# Altium schematic sheet Regulators.SchDoc
size A; SheetNumber: 5; SheetTotal: 6
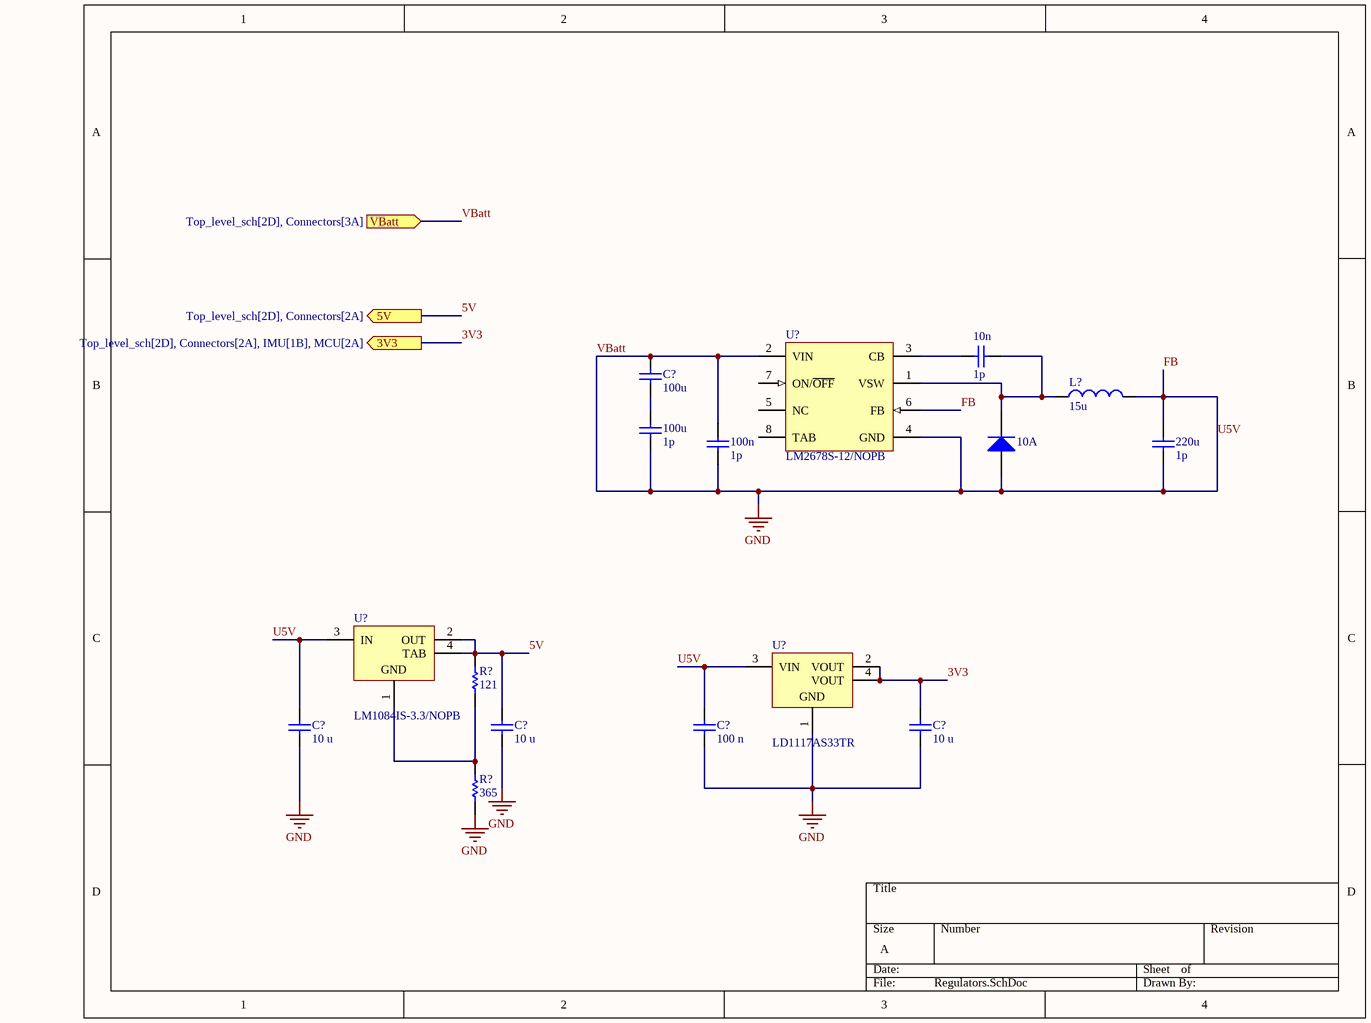
[diagram p0: Regulators.SchDoc]

## Parts
(Parts that share a designator on the sheet are numbered #1, #2 ... from top to bottom, then left to right.)
10A  Diode  (value not drawn)
10n  value 1p  (hidden comment: Capacitor)
100n  value 1p  (hidden comment: Capacitor)
100u  value 1p  (hidden comment: Capacitor)
220u  value 1p  (hidden comment: Capacitor)
C?#1  value 100u  (hidden comment: Capacitor)
C?#2  value 10 u  (hidden comment: Capacitor)
C?#3  value 10 u  (hidden comment: Capacitor)
C?#4  value 100 n  (hidden comment: Capacitor)
C?#5  value 10 u  (hidden comment: Capacitor)
L?  value 15u  (hidden comment: Inductor)
R?#1  value 121  (hidden comment: Resistor)
R?#2  value 365  (hidden comment: Resistor)
U?#1  LM2678S-12/NOPB  [KTW0007B_L]
U?#2  LM1084IS-3.3/NOPB  [KTT0003B_L]
U?#3  LD1117AS33TR  [SOT-223_L]

## Ports
3V3 (out, see Top_level_sch[2D], Connectors[2A], IMU[1B], MCU[2A]), 5V (out, see Top_level_sch[2D], Connectors[2A]), VBatt (in, see Top_level_sch[2D], Connectors[3A])

## Nets
FB: 10A.1(A) 100n.1 100n.2 100u.1 220u.1 220u.2 C?#1.2 C?#2.1 C?#2.2 C?#3.1 C?#4.1 C?#4.2 C?#5.1 L?.2 R?#2.1 U?#1.2(VIN) U?#1.4(GND) U?#1.6(FB) U?#2.3(IN) U?#3.1(GND) U?#3.3(VIN) ; port VBatt  [also labelled GND, U5V, VBatt]
3V3: C?#5.2 U?#3.2(VOUT) U?#3.4(VOUT) ; port 3V3
5V: C?#3.2 R?#1.2 U?#2.2(OUT) U?#2.4(TAB) ; port 5V
Net10A_2: 10A.2(K) 10n.2 L?.1 U?#1.1(VSW)
Net10n_1: 10n.1 U?#1.3(CB)
Net100u_2: 100u.2 C?#1.1
NetR?#1_1: R?#1.1 R?#2.2 U?#2.1(GND)

Not connected (* = marked no-connect by the designer): U?#1 5(NC) 7(ON/~{OFF}) 8(TAB)

## Library data of the parts
10A = Diode: AF: 1; BV: 0; BV_MAX: 1e99; EG: 1.11; FC: 0.5; IBV: 0.001; ISR: 1e-14; MJSW: 0.33; NTUN: 30; TNOM: 27; XTI: 3; SimulationGenericComponent: True; CJO: 0; CJP: 0; CTA: 0; CTP: 0; FCS: 0.5; FV_MAX: 1e99; IKF: 0; IKR: 0; JSW: 0; JTUN: 0; JTUNSW: 0; KEG: 1; KF: 0; LEVEL: 1; N: 1; NBV: 1; NR: 1; NS: 1; PHP: 1; RS: 0; TCV: 0; TLEV: 0; TLEVC: 0; TM1: 0; TM2: 0; TPB: 0; TPHP: 0; TRS: 0; TRS2: 0; TT: 0; TTT1: 0; TTT2: 0; VJ: 1; XTITUN: 3; IS: 1e-14
10n 100n 100u 220u C?#1 C?#2 C?#4 C?#5 = Capacitor: SimulationGenericComponent: True
C?#3 = Capacitor: Tantalum Capacitor; SimulationGenericComponent: True
L? = Inductor: SimulationGenericComponent: True
R?#1 R?#2 = Resistor: TC1: 0; SimulationGenericComponent: True; TC2: 0
U?#1 = CMP-0069-00193-3: SIMPLE SWITCHER® High Efficiency 5A Step-Down Voltage Regulator, 7-pin TO-263, Pb-Free; Manufacturer: Texas Instruments; PackageTopMarking: NSUZXYTTE#*LM2678*S-12; PowerWise: N; ComponentLink1URL: http://www.ti.com/general/docs/lit/getliterature.tsp?genericPartNumber=LM2678&fileType=pdf; RoHS: Y; PinCount: 7; ComponentLink1Description: Datasheet URL; CompType: Switcher; PackageDescription: TO-263, Molded, .400 x .390 x .180in Body, 7 Lead, .050in Pitch, Surface Mount; Code_JEDEC: MO-169-AC; PackageReference: KTW0007B
U?#2 = CMP-0062-00591-5: 5A Low Dropout Positive Regulators, 3-pin TO-263, Pb-Free; Manufacturer: Texas Instruments; High-Reliability: Y; CompType: LDO IC; PowerWise: N; PackageTopMarking: NSUZXYTTE#*LM1084*IS-3.3; PartNumber: LM1084IS-3.3/NOPB; PinCount: 3; ComponentLink1Description: Datasheet URL; Code_JEDEC: MO-169-AA; PackageDescription: TO-263, Molded, .400 x .390 x .180in, 3 Lead, .1in Pitch, Surface Mount; PackageReference: KTT0003B; RoHS: Y; ComponentLink1URL: http://www.ti.com/general/docs/lit/getliterature.tsp?genericPartNumber=LM1084&fileType=pdf
U?#3 = CMP-0244-00316-1: 1A, Low Drop Positive Voltage Regulator, 3.3V, 4-Pin SOT-223, Tape and Reel; ComponentLink1Description: Manufacturer URL; DatasheetVersion: 2/12/2011; PackageVersion: 2010; ComponentLink1URL: http://www.st.com; ComponentLink2Description: Datasheet; ComponentLink2URL: http://www.st.com/internet/com/TECHNICAL_RESOURCES/TECHNICAL_LITERATURE/DATASHEET/CD00002116.pdf; PackageDescription: 4-Pin SOT-223 Package, 6.5 x 3.5 mm Body, 2.3 mm Pitch, 7 mm Lead Span; PackageReference: SOT-223